# EasyEDA Pro project DPOV1.epro, schematic 474开发板

## Sheets
1 P1_CORE: Board Name: G474CORE; Create Date: 2025-02-21; Page Name: P1_CORE; Project Name: 大创; Schematic Name: 474开发板; Update Date: 2025-03-01; Company: 嘉立创EDA
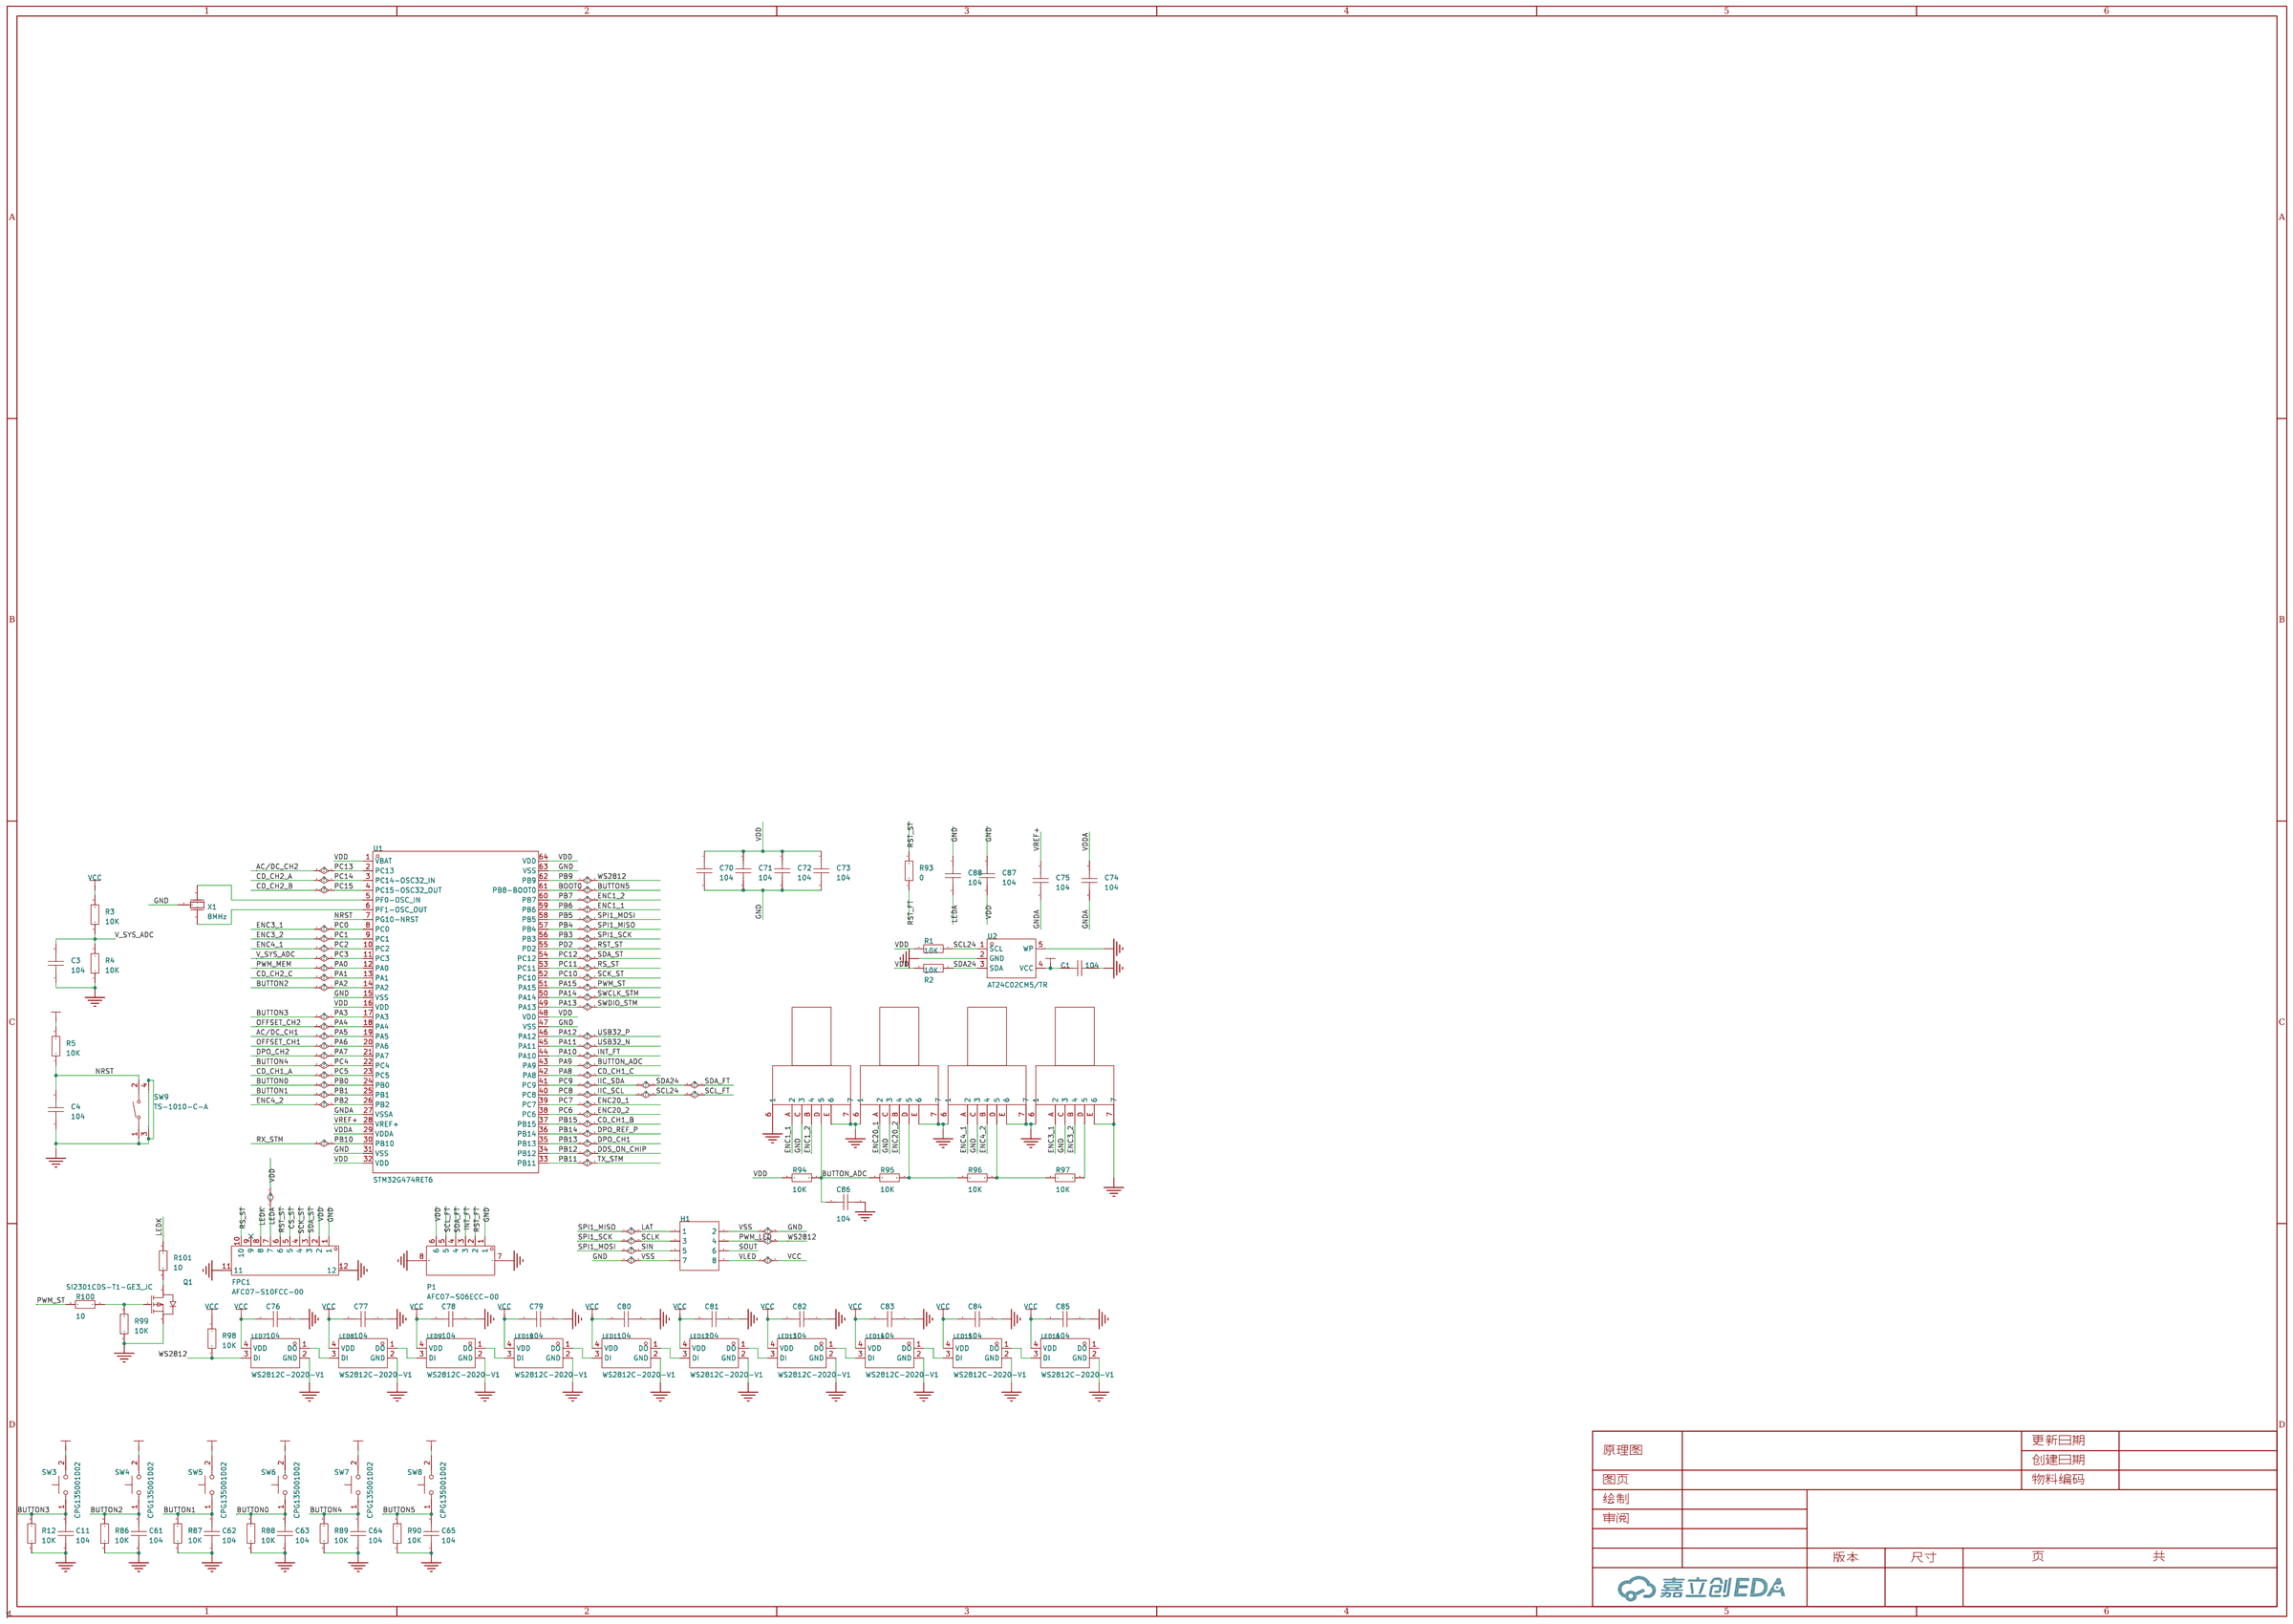
[diagram p0: P1_CORE]
2 P2_POWER: Create Date: 2025-02-23; Page Name: P2_POWER; Update Date: 2025-02-27
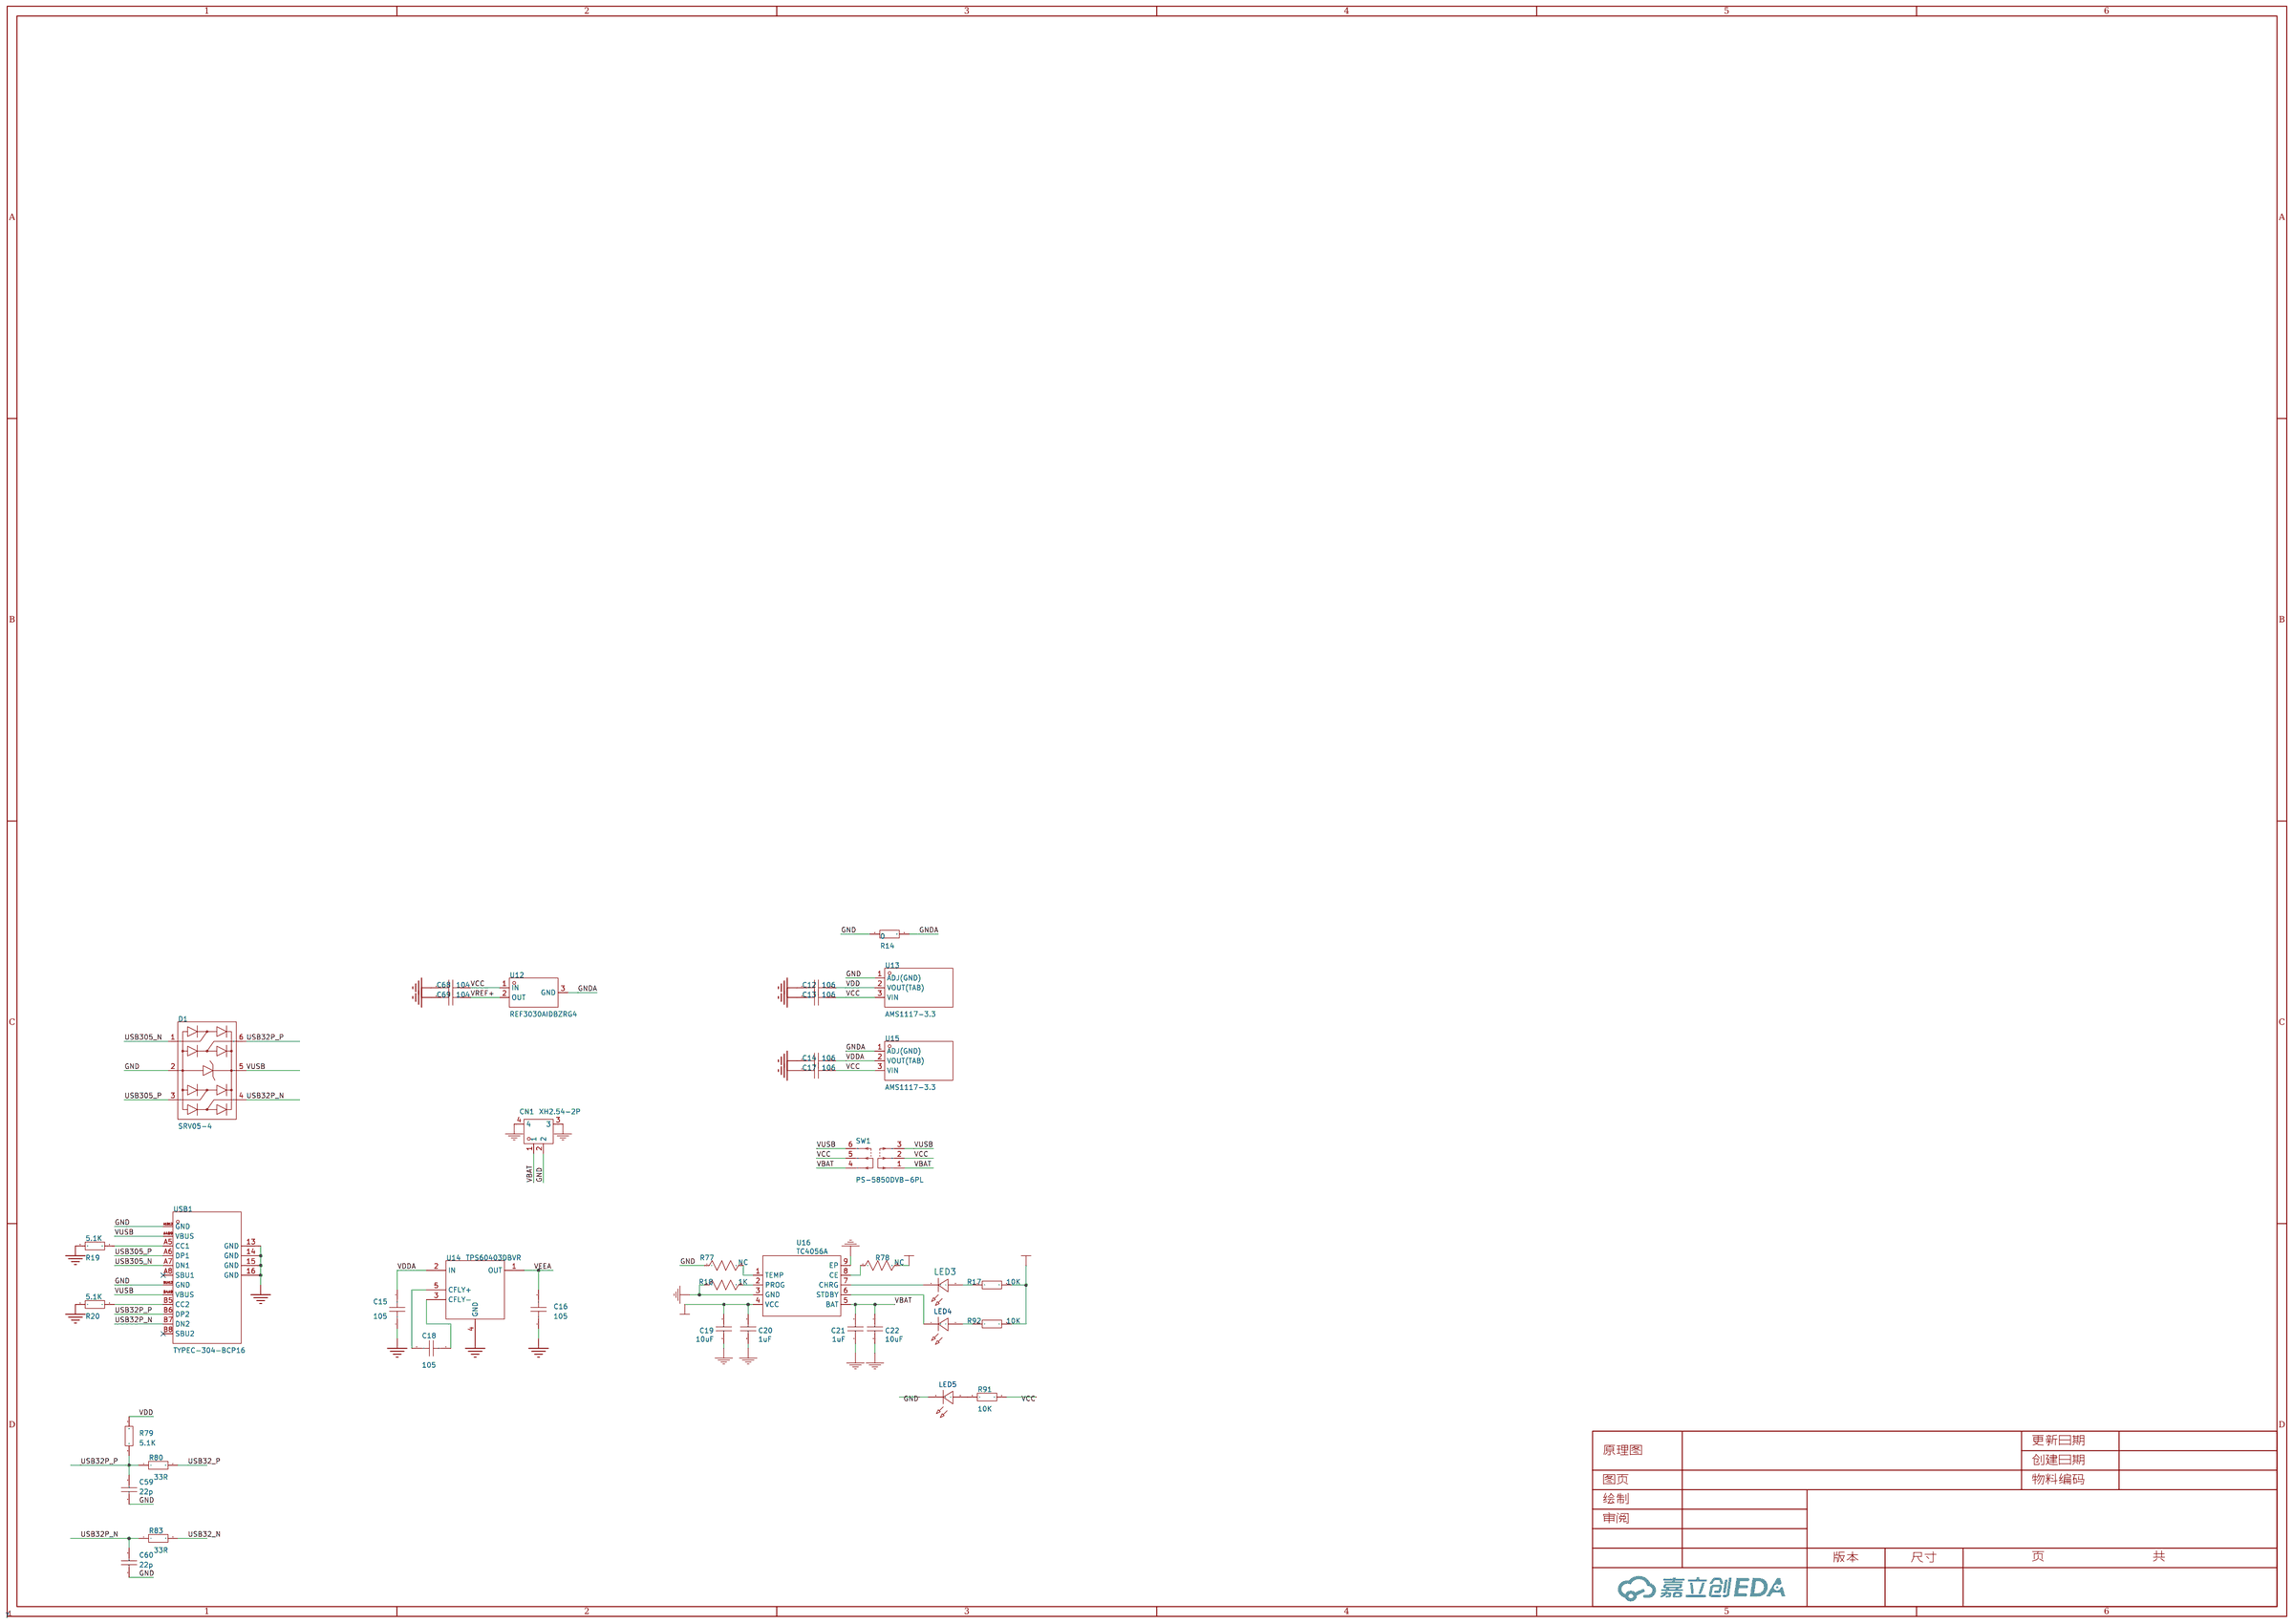
[diagram p1: P2_POWER]
3 P3_ANALOG: Create Date: 2025-02-23; Page Name: P3_ANALOG; Update Date: 2025-03-04
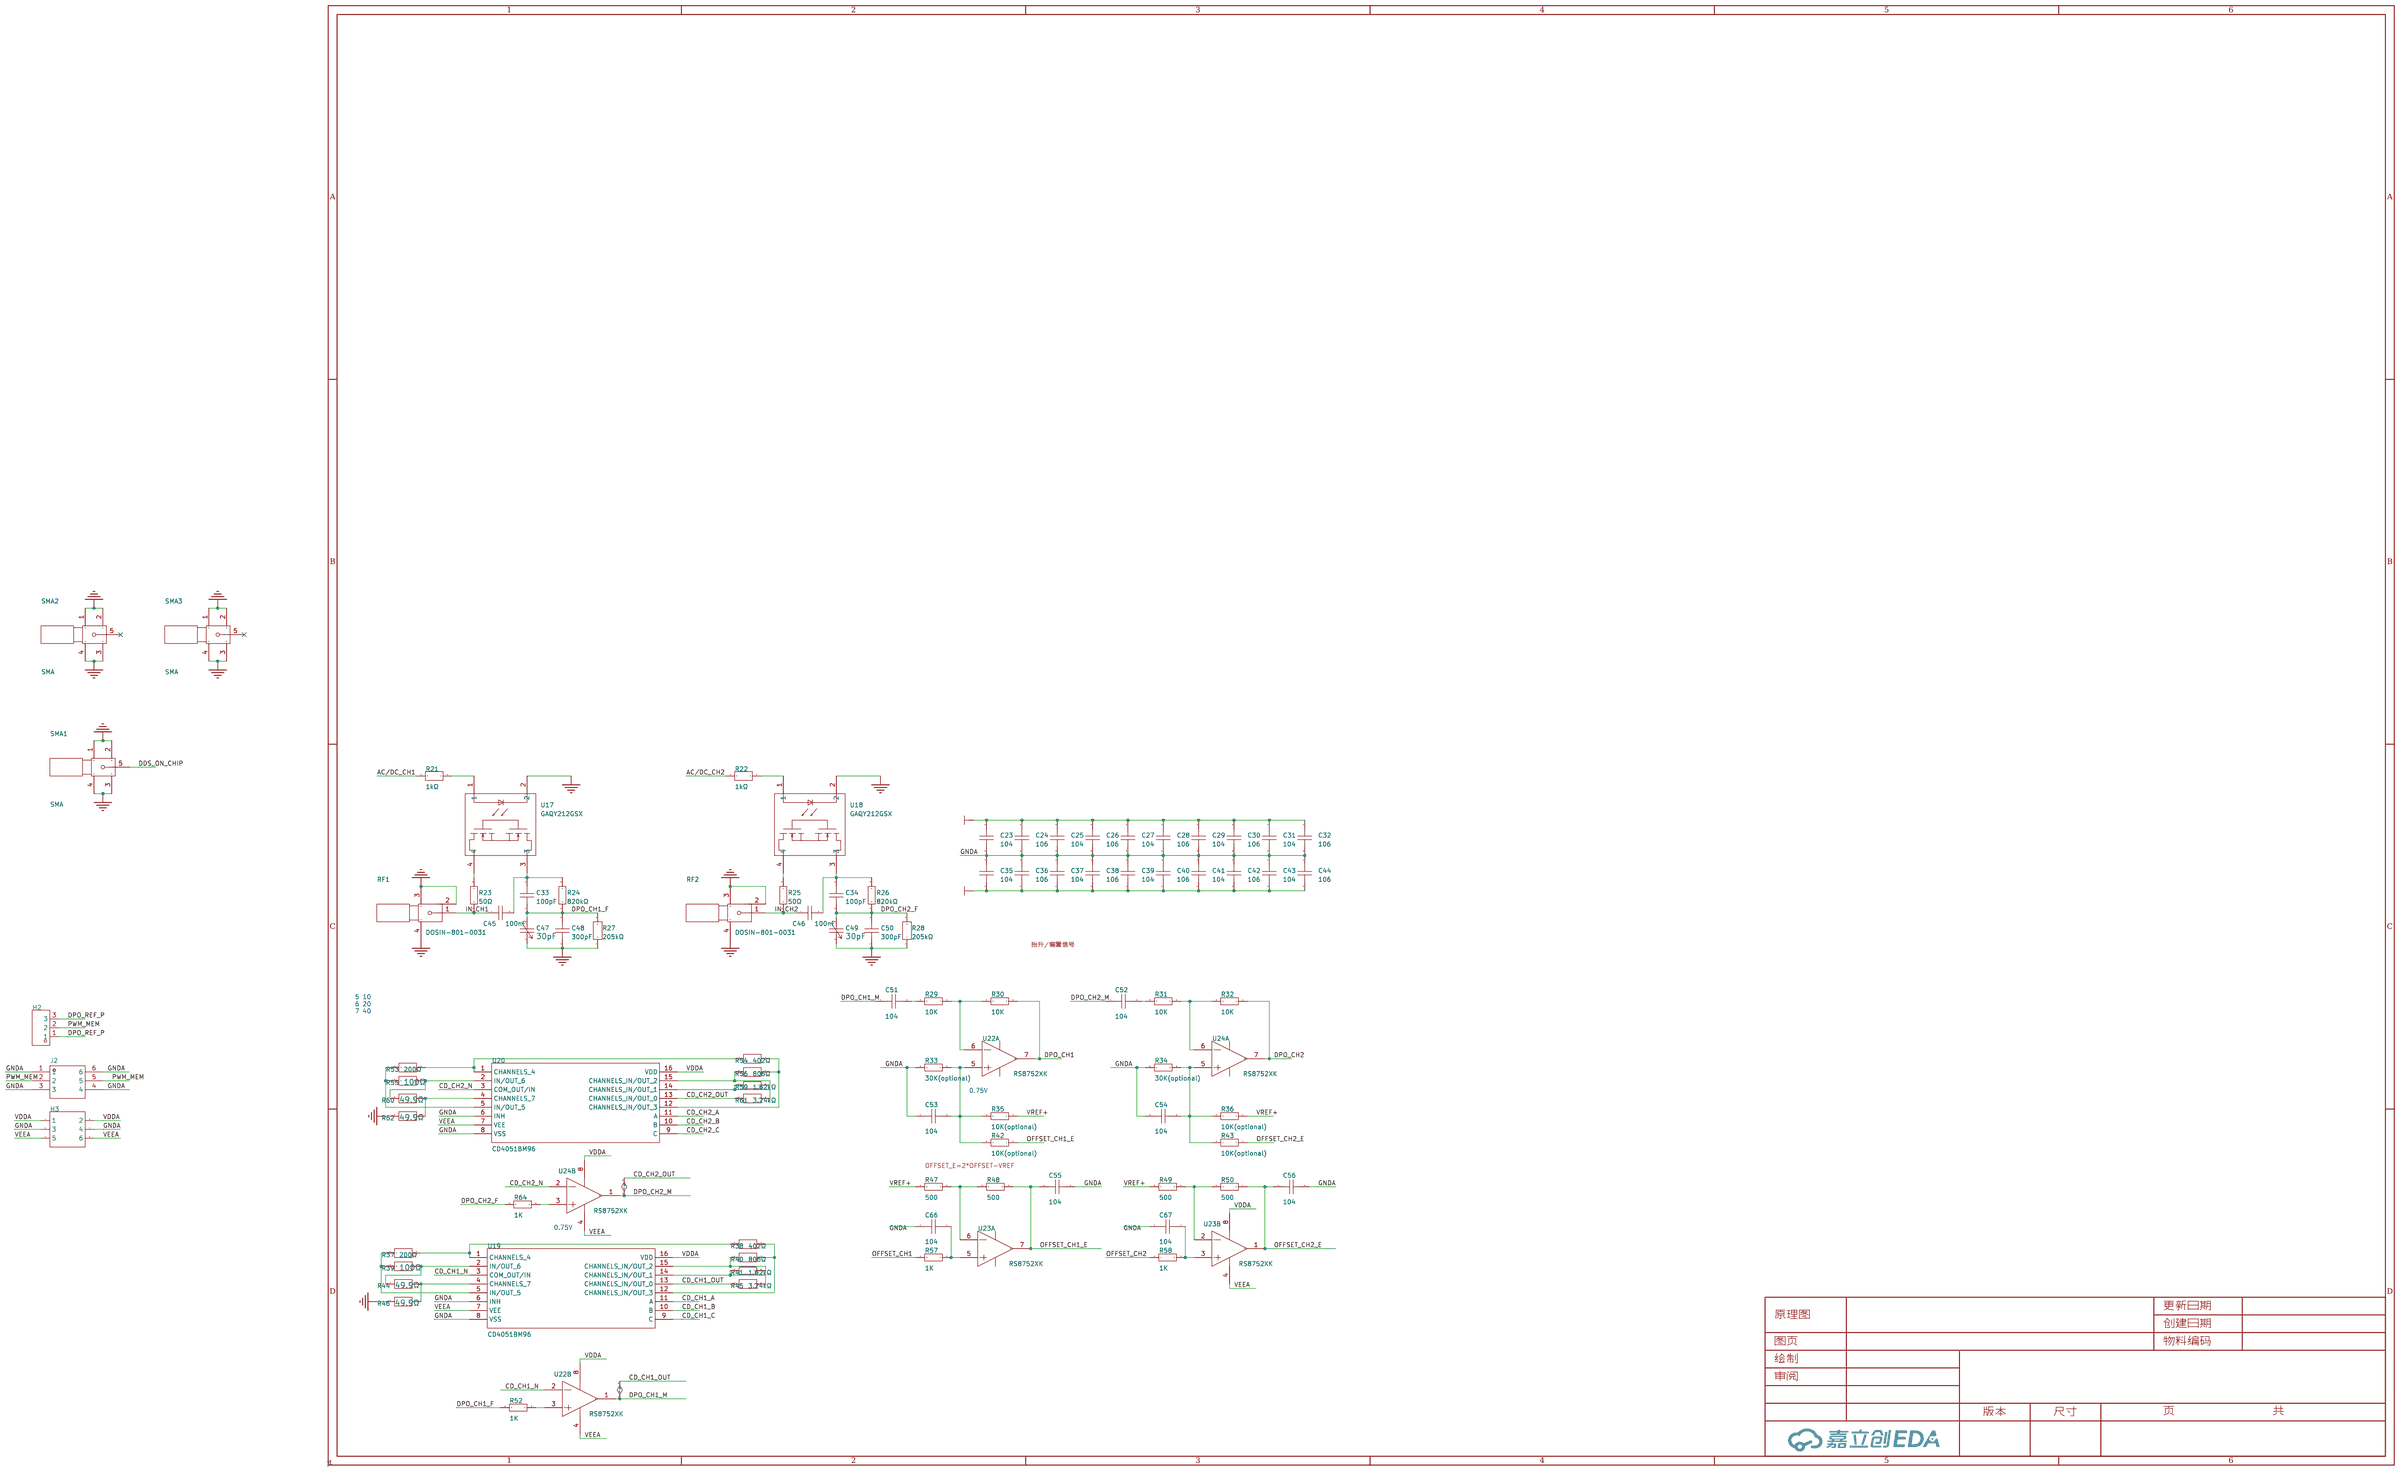
[diagram p2: P3_ANALOG]
4 P4_DAP: Create Date: 2025-02-24; Page Name: P4_DAP; Update Date: 2025-02-27; Page Size: A3; Version: V1.0
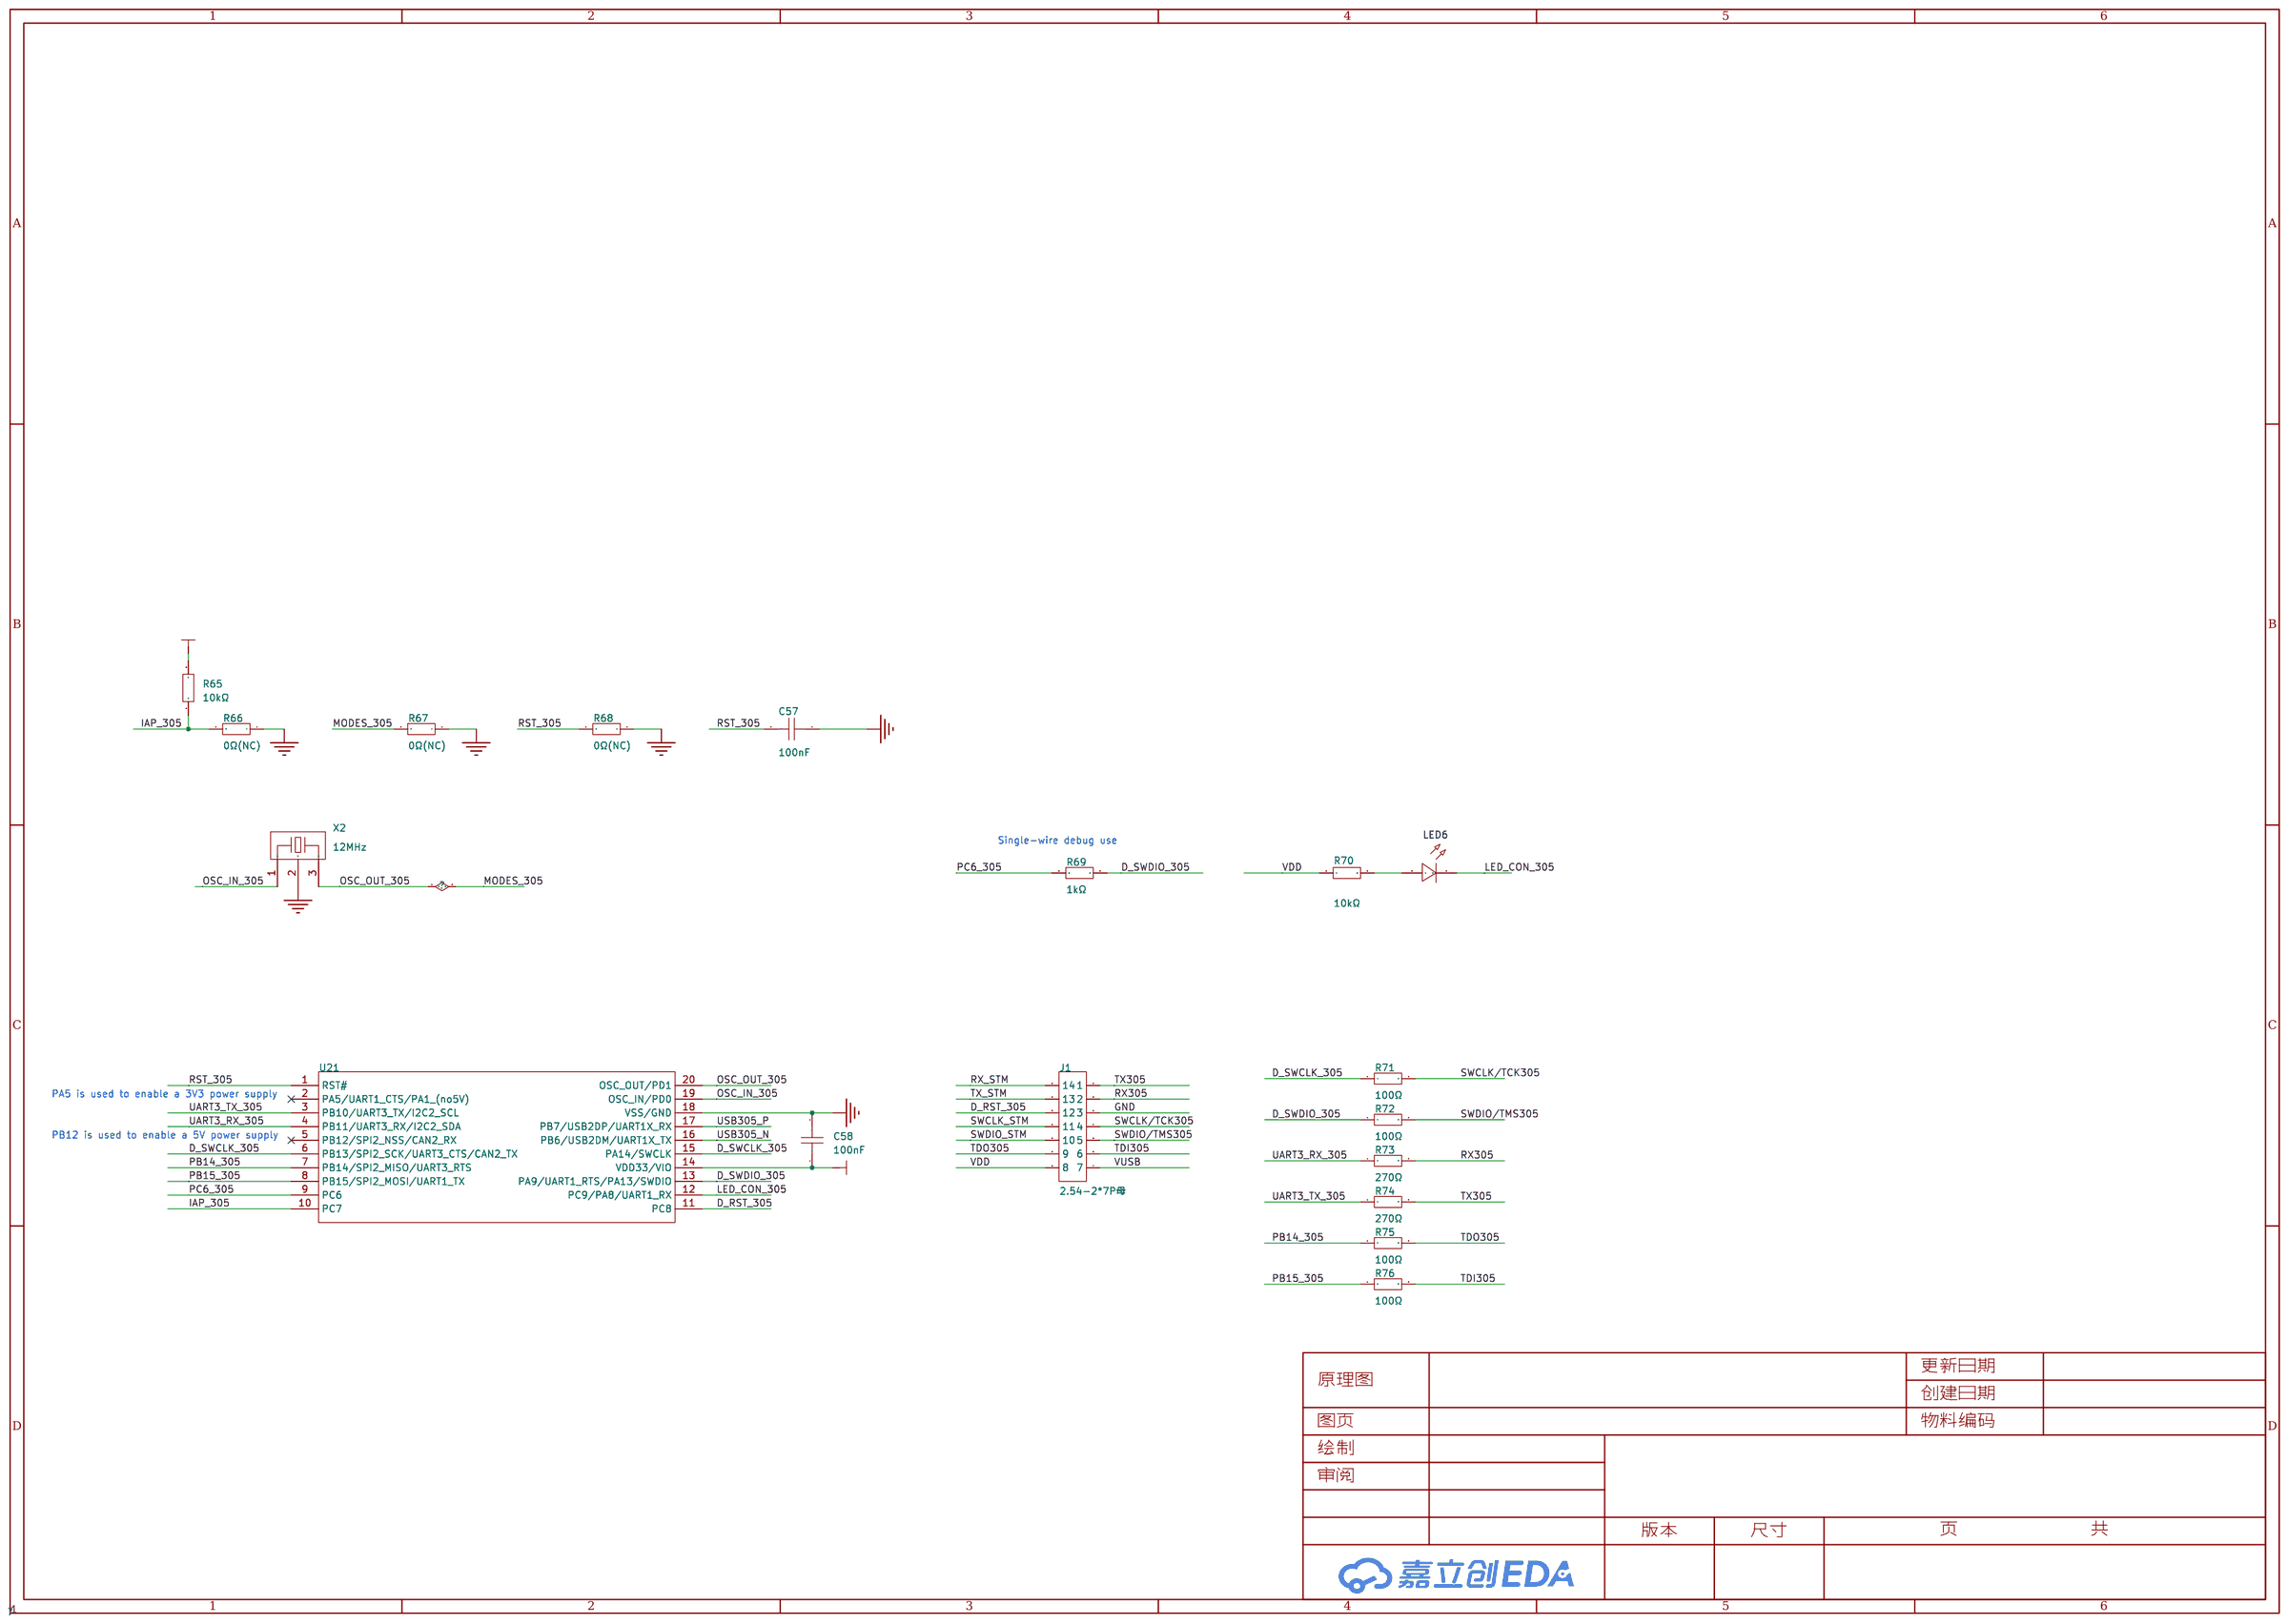
[diagram p3: P4_DAP]

## Parts
sheet P1_CORE
C1  104  [C0603]
C3  104  [C0603]
C4  104  [C0603]
C11  104  [C0603]
C61  104  [C0603]
C62  104  [C0603]
C63  104  [C0603]
C64  104  [C0603]
C65  104  [C0603]
C70  104  [C0603]
C71  104  [C0603]
C72  104  [C0603]
C73  104  [C0603]
C74  104  [C0603]
C75  104  [C0603]
C76  104  [C0603]
C77  104  [C0603]
C78  104  [C0603]
C79  104  [C0603]
C80  104  [C0603]
C81  104  [C0603]
C82  104  [C0603]
C83  104  [C0603]
C84  104  [C0603]
C85  104  [C0603]
C86  104  [C0603]
C87  104  [C0603]
C88  104  [C0603]
EC1  -  [ec11卧式立式编码器]
EC2  -  [ec11卧式立式编码器]
EC3  -  [ec11卧式立式编码器]
EC4  -  [ec11卧式立式编码器]
FPC1  AFC07-S10FCC-00  [FPC-SMD_P0.5-10P_LSXJ-H2.0-10P]
H1  -  [HDR-TH_8P-P2.54-V-F-R2-C4-S2.54-1]
LED7  WS2812C-2020-V1  [LED-SMD_4P-L2.0-W2.0-TL_WS2812B-2020]
LED8  WS2812C-2020-V1  [LED-SMD_4P-L2.0-W2.0-TL_WS2812B-2020]
LED9  WS2812C-2020-V1  [LED-SMD_4P-L2.0-W2.0-TL_WS2812B-2020]
LED10  WS2812C-2020-V1  [LED-SMD_4P-L2.0-W2.0-TL_WS2812B-2020]
LED11  WS2812C-2020-V1  [LED-SMD_4P-L2.0-W2.0-TL_WS2812B-2020]
LED12  WS2812C-2020-V1  [LED-SMD_4P-L2.0-W2.0-TL_WS2812B-2020]
LED13  WS2812C-2020-V1  [LED-SMD_4P-L2.0-W2.0-TL_WS2812B-2020]
LED14  WS2812C-2020-V1  [LED-SMD_4P-L2.0-W2.0-TL_WS2812B-2020]
LED15  WS2812C-2020-V1  [LED-SMD_4P-L2.0-W2.0-TL_WS2812B-2020]
LED16  WS2812C-2020-V1  [LED-SMD_4P-L2.0-W2.0-TL_WS2812B-2020]
P1  AFC07-S06ECC-00  [FPC-SMD_AFC07-S06ECC-00]
Q1  SI2301CDS-T1-GE3_JC  [SOT-23-3_L3.0-W1.7-P0.95-LS2.9-BR]
R1  10K  [R0603]
R2  10K  [R0603]
R3  10K  [R0603]
R4  10K  [R0603]
R5  10K  [R0603]
R12  10K  [R0603]
R86  10K  [R0603]
R87  10K  [R0603]
R88  10K  [R0603]
R89  10K  [R0603]
R90  10K  [R0603]
R93  0  [R0603]
R94  10K  [R0603]
R95  10K  [R0603]
R96  10K  [R0603]
R97  10K  [R0603]
R98  10K  [R0603]
R99  10K  [R0603]
R100  10  [R0603]
R101  10  [R0603]
SW3  CPG135001D02  [KEY-TH_CPG135001D0X]
SW4  CPG135001D02  [KEY-TH_CPG135001D0X]
SW5  CPG135001D02  [KEY-TH_CPG135001D0X]
SW6  CPG135001D02  [KEY-TH_CPG135001D0X]
SW7  CPG135001D02  [KEY-TH_CPG135001D0X]
SW8  CPG135001D02  [KEY-TH_CPG135001D0X]
SW9  TS-1010-C-A  [KEY-SMD_TX-1010-X-X]
U1  STM32G474RET6  [LQFP-64_L10.0-W10.0-P0.50-LS12.0-BL]
U2  AT24C02CM5/TR  [SOT-23-5_L2.9-W1.6-P0.95-LS2.8-BR]
X1  8MHz  [OSC-SMD_3P-L3.2-W1.3-P1.20-L]
sheet P2_POWER
C12  106  [C0805]
C13  106  [C0805]
C14  106  [C0805]
C15  105  [C0603]
C16  105  [C0603]
C17  106  [C0805]
C18  105  [C0603]
C19  10uF  [C0805]
C20  1uF  [C0603]
C21  1uF  [C0603]
C22  10uF  [C0805]
C59  22p  [C0603]
C60  22p  [C0603]
C68  104  [C0603]
C69  104  [C0603]
CN1  XH2.54-2P  [CONN-SMD_2P-P2.50-WT]
D1  SRV05-4  [SOT-23-6_L2.9-W1.6-P0.95-LS2.8-BL]
LED3  -  [LED_0603]
LED4  -  [LED_0603]
LED5  -  [LED_0603]
R14  0  [R0603]
R17  10K  [R0603]
R18  1K  [R0603]
R19  5.1K  [R0603]
R20  5.1K  [R0603]
R77  NC  [R0603]
R78  NC  [R0603]
R79  5.1K  [R0603]
R80  33R  [R0603]
R83  33R  [R0603]
R91  10K  [R0603]
R92  10K  [R0603]
SW1  PS-5850DVB-6PL  [SW-TH_6P-L5.8-W5.8-P2.00-LS4.5-BL_1]
U12  REF3030AIDBZRG4  [SOT-23-3_L2.9-W1.3-P1.90-LS2.4-BR]
U13  AMS1117-3.3  [SOT-89_L4.5-W2.5-P1.50-LS4.2-BR]
U14  TPS60403DBVR  [SOT-23-5_L3.0-W1.7-P0.95-LS2.8-BR]
U15  AMS1117-3.3  [SOT-89_L4.5-W2.5-P1.50-LS4.2-BR]
U16  TC4056A  [SOP-8_L4.9-W3.9-P1.27-LS6.0-BL-EP]
USB1  TYPEC-304-BCP16  [USB-C-SMD_TYPEC-304-BCP16]
sheet P3_ANALOG
C23  104  [C0603]
C24  106  [C0603]
C25  104  [C0603]
C26  106  [C0603]
C27  104  [C0603]
C28  106  [C0603]
C29  104  [C0603]
C30  106  [C0603]
C31  104  [C0603]
C32  106  [C0603]
C33  100pF  [C0603]
C34  100pF  [C0603]
C35  104  [C0603]
C36  106  [C0603]
C37  104  [C0603]
C38  106  [C0603]
C39  104  [C0603]
C40  106  [C0603]
C41  104  [C0603]
C42  106  [C0603]
C43  104  [C0603]
C44  106  [C0603]
C45  100nF  [C1206]
C46  100nF  [C1206]
C47  30pF  [CAP-ADJ-SMD_L4.5-W3.2-L]
C48  300pF  [C0603]
C49  30pF  [CAP-ADJ-SMD_L4.5-W3.2-L]
C50  300pF  [C0603]
C51  104  [C0603]
C52  104  [C0603]
C53  104  [C0603]
C54  104  [C0603]
C55  104  [C0603]
C56  104  [C0603]
C66  104  [C0603]
C67  104  [C0603]
H2  -  [HDR-TH_3P-P2.54-V-F]
H3  -  [HDR-TH_6P-P2.54-V-F-R2-C3-S2.54]
J2  -  [侧插排针_3Px2_2.54]
R21  1kΩ  [R0603]
R22  1kΩ  [R0603]
R23  50Ω  [R0603]
R24  820kΩ  [R0603]
R25  50Ω  [R0603]
R26  820kΩ  [R0603]
R27  205kΩ  [R0603]
R28  205kΩ  [R0603]
R29  10K  [R0603]
R30  10K  [R0603]
R31  10K  [R0603]
R32  10K  [R0603]
R33  30K(optional)  [R0603]
R34  30K(optional)  [R0603]
R35  10K(optional)  [R0603]
R36  10K(optional)  [R0603]
R37  200Ω  [R0603]
R38  402Ω  [R0603]
R39  100Ω  [R0603]
R40  806Ω  [R0603]
R41  1.62kΩ  [R0603]
R42  10K(optional)  [R0603]
R43  10K(optional)  [R0603]
R44  49.9Ω  [R0603]
R45  3.24kΩ  [R0603]
R46  49.9Ω  [R0603]
R47  500  [R0603]
R48  500  [R0603]
R49  500  [R0603]
R50  500  [R0603]
R52  1K  [R0603]
R53  200Ω  [R0603]
R54  402Ω  [R0603]
R55  100Ω  [R0603]
R56  806Ω  [R0603]
R57  1K  [R0603]
R58  1K  [R0603]
R59  1.62kΩ  [R0603]
R60  49.9Ω  [R0603]
R61  3.24kΩ  [R0603]
R62  49.9Ω  [R0603]
R64  1K  [R0603]
RF1  DOSIN-801-0031  [BNC-TH_DOSIN-801-0030]
RF2  DOSIN-801-0031  [BNC-TH_DOSIN-801-0030]
SMA1  SMA  [SMA-SMD_BWSMA-KE-P001]
SMA2  SMA  [SMA-SMD_BWSMA-KE-P001]
SMA3  SMA  [SMA-SMD_BWSMA-KE-P001]
U17  GAQY212GSX  [SOP-4_L4.3-W4.4-P2.54-LS6.8-TR]
U18  GAQY212GSX  [SOP-4_L4.3-W4.4-P2.54-LS6.8-TR]
U19  CD4051BM96  [SOIC-16_L9.9-W3.9-P1.27-LS6.0-BL]
U20  CD4051BM96  [SOIC-16_L9.9-W3.9-P1.27-LS6.0-BL]
U22  RS8752XK  [SOIC-8_L4.9-W3.9-P1.27-LS6.0-BL]  (sections 1,2)
U23  RS8752XK  [SOIC-8_L4.9-W3.9-P1.27-LS6.0-BL]  (sections 1,2)
U24  RS8752XK  [SOIC-8_L4.9-W3.9-P1.27-LS6.0-BL]  (sections 1,2)
sheet P4_DAP
C57  100nF  [C0603]
C58  100nF  [C0603]
J1  2.54-2*7P母  [排母_2X7P_2.54_双层]
LED6  -  [LED_0603]
R65  10kΩ  [R0603]
R66  0Ω(NC)  [R0603]
R67  0Ω(NC)  [R0603]
R68  0Ω(NC)  [R0603]
R69  1kΩ  [R0603]
R70  10kΩ  [R0603]
R71  100Ω  [R0603]
R72  100Ω  [R0603]
R73  270Ω  [R0603]
R74  270Ω  [R0603]
R75  100Ω  [R0603]
R76  100Ω  [R0603]
U21  -  [TSSOP-20_L6.5-W4.4-P0.65-LS6.4-BL]
X2  12MHz  [OSC-SMD_3P-L3.2-W1.3-P1.2-L]

## Library data of the parts
C1 C3 C4 C11 C23-C32 C35-C44 C51-C56 C61-C67 C70-C88 = CAP_0603: Supplier Footprint: 0603
EC1-EC4 = ec11卧式: ec11卧式 厚底 带开关 15MM
FPC1 = AFC07-S10FCC-00: 锁定特性:抽屉式;触点类型:下接;触点数量:10P;间距:0.5mm;安装类型:卧贴;; LCSC Part Name: 间距:0.5mm P数:10P 抽屉式 下接; Supplier Part: C11050; Manufacturer: JS(钜硕电子); Supplier Footprint: SMD,P=0.5mm,卧贴; JLCPCB Part Class: 扩展库; Datasheet: https://atta.szlcsc.com/upload/public/pdf/source/20190717/C405328_807FA67B3F1B55207D2BA590F8028B61.pdf; Supplier: LCSC; Locking Feature: 抽屉式; Contact Type: 下接; Number of Contacts: 10P; Pitch: 0.5mm; Mounting Type: 卧贴; FFC, FCB Thickness: 0.3mm; Height Above Board: 2mm
H1 = HDR-F_2.54_2x4: Supplier Part: C92271; Supplier Footprint: 插件
LED7-LED16 = WS2812C-2020-V1: 发光颜色:RGB三色;二极管配置:-;透镜颜色:-;主波长:624nm；520nm；467nm;色温:-;功率:-;发光角度:-;安装方式:-;工作温度:-;; LCSC Part Name: RGB三色 （注意防潮，请查阅规格书中对应具体内容）; Supplier Part: C2976072; Manufacturer: worldsemi; Supplier Footprint: SMD,2x2mm; JLCPCB Part Class: 扩展库; Datasheet: https://atta.szlcsc.com/upload/public/pdf/source/20220222/52A01000447F5320C9A8C3F34CEFDB81.pdf; Supplier: LCSC; Emitted Color: RGB三色; Dominant Wavelength: 624nm；520nm；467nm
P1 = AFC07-S06ECC-00: 锁定特性:抽屉式;触点类型:上接;触点数量:6P;间距:0.5mm;安装类型:卧贴;; LCSC Part Name: 间距:0.5mm P数:6P 抽屉式 上接; Supplier Part: C11083; Manufacturer: JS(钜硕电子); Supplier Footprint: SMD,P=0.5mm,卧贴; JLCPCB Part Class: 扩展库; Datasheet: https://atta.szlcsc.com/upload/public/pdf/source/20190816/C413943_B2A877D529C9540F79BD785FB8B72D0A.pdf; Supplier: LCSC; Locking Feature: 抽屉式; Contact Type: 上接; Number of Contacts: 6P; Pitch: 0.5mm; Mounting Type: 卧贴; FFC, FCB Thickness: 0.3mm; Height Above Board: 2mm
Q1 = SI2301CDS-T1-GE3_JC: link: https://item.szlcsc.com/139341.html; 3DModel: SOT-23-3L_L2.9-W1.6-H1.1-LS2.8-P0.95; Supplier: LCSC; Manufacturer: VISHAY; Manufacturer Part: SI2301CDS-T1-GE3; Supplier Part: C10487; JLCPCB Part Class: Basic Part
R1 R2 R14 R19 R20 R79 R80 R83 R98 = Res_0603: Supplier Footprint: 0603
R3-R5 R12 R17 R29-R36 R42 R43 R47-R50 R52 R57 R58 R64 R86-R97 R99-R101 = 1K: Supplier: LCSC; Manufacturer: UniOhm; Manufacturer Part: 0603WAJ0102T5E; Supplier Part: C25585
SW3-SW8 = CPG135001D02: 轴类型:茶轴;工作电压:12V;针脚数:2;操作力:50gf@±10gf;; LCSC Part Name: CHOC 茶轴; Supplier Part: C400230; Manufacturer: Kailh(凯华); Supplier Footprint: 插件; JLCPCB Part Class: 扩展库; Datasheet: https://atta.szlcsc.com/upload/public/pdf/source/20190626/C400230_CD79EE7C25BDE8A0B9D940627C7F841C.pdf; Supplier: LCSC; Axis Type: 茶轴; Operating Voltage: 12V; Pin: 2; Mechanical Life: 7000万次; Operation Force: 50gf@±10gf; Conduction Travel: 1.5mm; Total Travel: 3mm; Operating Temperature: -20℃~+80℃
SW9 = TS-1010-C-A: 电路结构:单刀单掷;按钮形状:矩形按钮;作用力:260gf;安装方式:卧贴;开关长度:2.3mm;开关宽度:4.7mm;开关高度:3.5mm;带支架:不带;触点电流:50mA;额定电压(AC):-;额定电压(DC):12V;额定功率:-;绝缘电阻:-;带灯:无;机械寿命:10万次;; LCSC Part Name: 2.3*4.7*3.5mm 卧贴 轻触开关; Supplier Part: C692458; Manufacturer: XKB Connectivity(中国星坤); Supplier Footprint: SMD; JLCPCB Part Class: 扩展库; Datasheet: https://atta.szlcsc.com/upload/public/pdf/source/20211011/09621D275CE0F472C941775DFBBCCC96.pdf; Supplier: LCSC; Circuit: 单刀单掷; Actuator Style: 矩形按钮; Operating Force: 260gf; Mounting Style: 卧贴; Switch Length: 2.3mm; Switch Width: 4.7mm; Switch Height: 3.5mm; Strike Gundam: 不带; Contact Current: 50mA; Voltage Rating (DC): 12V; Actuator/Cap Color: 黑色; With Lamp: 无; Mechanical Life: 10万次; Operating Temperature: -30℃~+85℃
U1 = STM32G474RET6: CPU内核:ARM-M4;CPU最大主频:170MHz;应用领域:-;; LCSC Part Name: 带DSP和FPU的170MHz主流ARM Cortex-M4 MCU，具有512 KB Flash存储器、数学加速器、高分辨率定时器和高模拟电平集成; Supplier Part: C521608; Manufacturer: ST(意法半导体); Supplier Footprint: LQFP-64(10x10); JLCPCB Part Class: 扩展库; Datasheet: https://atta.szlcsc.com/upload/public/pdf/source/20200902/C431632_38212262685EE30B1989689374F08940.pdf; Supplier: LCSC; CPU Core: ARM-M4; CPU Maximum Speed: 170MHz; Program Storage Size: 512KB; Program Memory Type: FLASH; Number of I/O: 52; ADC (Bit): 12bit; DAC (Bit): 12bit; Low Voltage Detection Threshold: 1.71V~3.6V
U2 = AT24C02CM5/TR: 存储容量:2Kbit;; Supplier Part: C7432363; Manufacturer: HGSEMI(华冠); Supplier Footprint: SOT23-5; Datasheet: https://atta.szlcsc.com/upload/public/pdf/source/20231225/2784EBC5D3B0DE823E6E0FE836346417.pdf; Supplier: LCSC; Memory Size: 2Kbit
X1 = CSTNE8M00G550000R0: 频率:8MHz;内置负载电容:33pF;谐振阻抗:40Ω;; LCSC Part Name: 8MHz ±0.5% 内置负载电容:33pF; Supplier Part: C341522; Manufacturer: muRata(村田); Supplier Footprint: SMD3213-3P; JLCPCB Part Class: 扩展库; Datasheet: https://atta.szlcsc.com/upload/public/pdf/source/20200921/C341522_F8E1D39D851DC808AB58F6F0A3A6E62B.pdf; Supplier: LCSC; Built-in Load Capacitance: 33pF; Resonant Impedance: 40Ω; Operating Temperature: -40℃~+85℃
C12-C14 C17 = CAP_0805: Supplier Footprint: 0805
C15 C16 C18 = CAP_0603: Supplier Footprint: 0805
C19 C22 = 10uF: Supplier: LCSC; Manufacturer Part: CL21A106KOQNNNE; Manufacturer: SAMSUNG; Supplier Part: C1713
C20 C21 C59 C60 = 1uF: Supplier: LCSC; Manufacturer Part: CL10A105KO8NNNC; Manufacturer: SAMSUNG; Supplier Part: C1592
C68 C69 = CAP_0805
CN1 = XH2.54-2P: Supplier Part: C9900004348; Supplier Footprint: XH2.54-2PSMD; JLCPCB Part Class: 扩展库; Supplier: LCSC
D1 = SRV05-4_C558418: 极性:单向;反向截止电压(Vrwm):5V;最大钳位电压:20V;峰值脉冲电流(Ipp):3A;峰值脉冲功率(Ppp):60W;击穿电压:6V;; LCSC Part Name: ESD，可防25kV静电; Supplier Part: C558418; Manufacturer: TECH PUBLIC(台舟); Supplier Footprint: SOT-23-6; JLCPCB Part Class: 扩展库; Datasheet: https://atta.szlcsc.com/upload/public/pdf/source/20230615/CFFDFFE99FDA0E92DF9600783B3A2A20.pdf; Supplier: LCSC; polarity: 单向; Reverse Stand-Off Voltage (Vrwm): 5V; Maximum Clamping Voltage: 20V; Peak Pulse Current (Ipp): 3A; Peak Pulse Power Dissipation (Ppp): 60W; Breakdown Voltage: 6V; Reverse Leakage Current (Ir): 500nA; Number of Lines: 四路; Operating Temperature: -55℃~+125℃; level of protection: IEC 61000-4-2; Type: ESD
LED3 = LED_0603-R: Supplier Footprint: 0603
LED4 LED6 = LED_0603-G: Supplier Footprint: 0603
LED5 = LED_0603-B: Supplier Footprint: 0603
R18 R77 R78 = 2K
SW1 = PS-5850DVB-6PL: 触点电流:500mA;额定电压 (DC):24V;; LCSC Part Name: 5.8×5.8六脚插板按键开关 自锁 250gf 3万寿命; Supplier Part: C5362624; Manufacturer: G-Switch(品赞); Supplier Footprint: 插件-6P,5.8x5.8mm; JLCPCB Part Class: 扩展库; Datasheet: https://atta.szlcsc.com/upload/public/pdf/source/20240529/335105E18CBD9563AE4F09DBBFA4E8D9.pdf; Supplier: LCSC; Contact Current: 500mA; Voltage Rating (DC): 24V; Insulation Resistance: 100MΩ; Actuator/Cap Color: 白色; Operating Temperature: -40℃~+85℃
U12 = REF3030AIDBZRG4: 输出类型:固定;输入电压:3.05V~5.5V;输出电压:3V;输出电流:25mA;精度:±0.2%;; Supplier Part: C2157098; Manufacturer: TI(德州仪器); Supplier Footprint: SOT-23-3; JLCPCB Part Class: 扩展库; Datasheet: https://www.ti.com/cn/lit/gpn/ref3012; Supplier: LCSC; Output Type: 固定; Input Voltage: 3.05V~5.5V; Output Voltage: 3V; Output Current: 25mA; Tolerance: ±0.2%; Temperature Coefficient: 75ppm/℃; Reference Type: 串联; Supply Current: 50uA; Noise - 1/10Hz to 10Hz: 33uVp-p; Noise - 10Hz to 10kHz: 94uVrms; Operating Temperature: -40℃~+125℃@(Ta)
U13 U15 = AMS1117-3.3_C347256: 输出类型:固定;最大输入电压:12V;输出电压:3.3V;最大输出电流:1A;电源纹波抑制比(PSRR):60dB@(120Hz);输出极性:正极;; LCSC Part Name: 输出:3.3V 电流:1A 耐压:12V; Supplier Part: C347256; Manufacturer: UMW(友台半导体); Supplier Footprint: SOT-89; JLCPCB Part Class: 扩展库; Datasheet: https://atta.szlcsc.com/upload/public/pdf/source/20231109/155D79A26D9DB04352555A58D5969DC8.pdf; Supplier: LCSC; Output Type: 固定; Maximum Input Voltage: 12V; Output Voltage: 3.3V; MAX Output Current: 1A; Power Supply Rejection Ratio (PSRR): 60dB@(120Hz); Dropout Voltage: 1.3V@(1A); Output Polarity: 正极; Number of Outputs: 1
U14 = TPS60403DBVR: TPS60403 具有固定 250kHz 操作的 60mA 充电泵电压反向器; Supplier Part: C11338; Manufacturer: TI(德州仪器); Supplier Footprint: SOT-23-5; Datasheet: https://www.ti.com/cn/lit/gpn/tps60403; Supplier: LCSC
U16 = TC4056A: Supplier: LCSC; Manufacturer: FM; Supplier Part: C84051; JLCPCB Part Class: Extend
USB1 = TYPEC-304-BCP16_C720629: 连接器类型:Type-C;标准:USB 3.1;公母:母;端口数量:1;触点数量:16P;安装方式:卧贴;额定电流 - 电源:3A;工作温度范围:-25℃~+85℃;焊接温度(最大值):260℃;; LCSC Part Name: Type-C 母 卧贴 停产; Supplier Part: C720629; Manufacturer: XUNPU(讯普); Supplier Footprint: SMD; JLCPCB Part Class: 扩展库; Datasheet: https://atta.szlcsc.com/upload/public/pdf/source/20220210/1FE0FEFF7D6A20C111212527D3DED014.pdf; Supplier: LCSC; Connector Type: Type-C; Standard: USB 3.1; Gender: 母; Number of Ports: 1; Number of Contacts: 16P; Mounting Style: 卧贴; Current Rating - Power (Max): 3A; Operating Temperature Range: -25℃~+85℃; Soldering Temperature(Max): 260℃
C33 C34 = CC0603KRX7R9BB101: 容值:100pF;精度:±10%;额定电压:50V;材质(温度系数):X7R;; LCSC Part Name: 100pF±10%50V; Supplier Part: C160903; Manufacturer: YAGEO(国巨); Supplier Footprint: 0603; JLCPCB Part Class: ExtendedPart; Datasheet: https://atta.szlcsc.com/upload/public/pdf/source/20171221/C160903_15138401031061196218.pdf; Supplier: LCSC; Tolerance: ±10%; Voltage Rated: 50V; Temperature Coefficient: X7R
C45 C46 = GRM31C5C1H104JA01L: 容值:100nF;精度:±5%;额定电压:50V;材质(温度系数):C0G;; LCSC Part Name: 100nF±5%50V; Supplier Part: C97946; Manufacturer: muRata(村田); Supplier Footprint: 1206; JLCPCB Part Class: 扩展库; Datasheet: https://atta.szlcsc.com/upload/public/pdf/source/20180228/C97946_15198056954501377706.pdf; Supplier: LCSC; Tolerance: ±5%; Voltage Rated: 50V; Temperature Coefficient: C0G
C47 C49 = TZC3P300A110R00: 静电容量:6.5pF~30pF;静电容量公差:0%~+50%;额定电压(Vdc):100V;Q值:300@1MHz;工作温度:-25~+85;电容体长:-;电容体宽:-;电容体高:-;; LCSC Part Name: 6.5pF~30pF0%~+50%; Supplier Part: C107707; Manufacturer: muRata(村田); Supplier Footprint: SMD,4.5x3.2x1.6mm; JLCPCB Part Class: 扩展库; Datasheet: https://atta.szlcsc.com/upload/public/pdf/source/20190308/C107707_FDFA4272F903C73E80F4FCF3941301D8.pdf; Supplier: LCSC; electrostatic capacity: 6.5pF~30pF; Tolerance: 0%~+50%; Rated Voltage: 100V; Q @ Freq: 300@1MHz; Operating Temperature: -25~+85
C48 C50 = 0603B301K500NT: 容值:300pF;精度:±10%;额定电压:50V;温度系数:X7R;; LCSC Part Name: 300pF±10%50V; Supplier Part: C1610; Manufacturer: FH(风华); Supplier Footprint: 0603; JLCPCB Part Class: ExtendedPart; Datasheet: https://atta.szlcsc.com/upload/public/pdf/source/20170923/C1610_1506149291282988409.pdf; Supplier: LCSC; Tolerance: ±10%; Voltage Rated: 50V; Temperature Coefficient: X7R
H2 = HDR-F_2.54_1x3P: Supplier Part: C541850; Supplier Footprint: 插件
H3 = HDR-F_2.54_2x3: Supplier Part: C92272; Supplier Footprint: 插件
J2 = 侧插排针_3Px2_2.54
R21 R22 = ERJ3EKF1743V: 阻值:174kΩ;精度:±1%;功率:100mW;温度系数:±100ppm/;最大工作电压:150V;工作温度范围:-55~+155;; LCSC Part Name: 174kΩ±1%100mW; Supplier Part: C400654; Manufacturer: PANASONIC(松下); Supplier Footprint: 0603; JLCPCB Part Class: 扩展库; Datasheet: https://atta.szlcsc.com/upload/public/pdf/source/20190625/C400654_D28930F178E2CC63F2998BCEC6060233.pdf; Supplier: LCSC; Tolerance: ±1%; Power(Watts): 100mW; Temperature Coefficient: ±100ppm/; Overload Voltage (Max): 150V; Operating Temperature Range: -55~+155
R23 R25 = RMS06FT8253: 精度:±1%;阻值:825kΩ;温度系数:±100ppm/;功率:1/10W;电阻类型:厚膜电阻;最大工作电压:50V;工作温度范围:-55~+155;; LCSC Part Name: 825kΩ±1%; Supplier Part: C209207; Manufacturer: 台湾大毅; Supplier Footprint: 0603; JLCPCB Part Class: 扩展库; Datasheet: https://atta.szlcsc.com/upload/public/pdf/source/20181220/C209207_DD44E2F6D51D02D6F55891039E79676D.pdf; Supplier: LCSC; Tolerance: ±1%; Temperature Coefficient: ±100ppm/; Power(Watts): 1/10W; Type: 厚膜电阻; Overload Voltage (Max): 50V; Operating Temperature Range: -55~+155
R24 R26 = RMS06FT8253: 精度:±1%;阻值:825kΩ;温度系数:±100ppm/;功率:1/10W;电阻类型:厚膜电阻;最大工作电压:50V;工作温度范围:-55~+155;; LCSC Part Name: 825kΩ±1%; Supplier Part: C322006; Manufacturer: 台湾大毅; Supplier Footprint: 0603; JLCPCB Part Class: 扩展库; Datasheet: https://atta.szlcsc.com/upload/public/pdf/source/20181220/C209207_DD44E2F6D51D02D6F55891039E79676D.pdf; Supplier: LCSC; Tolerance: ±1%; Temperature Coefficient: ±100ppm/; Power(Watts): 1/10W; Type: 厚膜电阻; Overload Voltage (Max): 50V; Operating Temperature Range: -55~+155
R27 R28 = ERJ3EKF1743V: 阻值:174kΩ;精度:±1%;功率:100mW;温度系数:±100ppm/;最大工作电压:150V;工作温度范围:-55~+155;; LCSC Part Name: 174kΩ±1%100mW; Supplier Part: C185351; Manufacturer: PANASONIC(松下); Supplier Footprint: 0603; JLCPCB Part Class: 扩展库; Datasheet: https://atta.szlcsc.com/upload/public/pdf/source/20190625/C400654_D28930F178E2CC63F2998BCEC6060233.pdf; Supplier: LCSC; Tolerance: ±1%; Power(Watts): 100mW; Temperature Coefficient: ±100ppm/; Overload Voltage (Max): 150V; Operating Temperature Range: -55~+155
R37 R53 = RC0603FR-07200RL: 阻值:200Ω;精度:±1%;功率:100mW;温度系数:±100ppm/℃;最大工作电压:75V;工作温度范围:-55℃~+155℃;; LCSC Part Name: 200Ω±1%100mW; Supplier Part: C114664; Manufacturer: YAGEO(国巨); Supplier Footprint: 0603; JLCPCB Part Class: ExtendedPart; Datasheet: https://atta.szlcsc.com/upload/public/pdf/source/20170912/C114664_1505207802969963457.pdf; Supplier: LCSC; Tolerance: ±1%; Power(Watts): 100mW; Temperature Coefficient: ±100ppm/℃; Overload Voltage (Max): 75V; Operating Temperature Range: -55℃~+155℃
R38 R54 = ERJ3EKF4020V: 阻值:402Ω;精度:±1%;功率:100mW;温度系数:±100ppm/;最大工作电压:-;工作温度范围:-55~+155;; LCSC Part Name: 402Ω±1%100mW; Supplier Part: C403205; Manufacturer: PANASONIC(松下); Supplier Footprint: 0603; JLCPCB Part Class: 扩展库; Datasheet: https://atta.szlcsc.com/upload/public/pdf/source/20190709/C403205_F6A86A0F3C62C4F5DB50373EB6C1874B.pdf; Supplier: LCSC; Tolerance: ±1%; Power(Watts): 100mW; Temperature Coefficient: ±100ppm/; Operating Temperature Range: -55~+155
R39 R55 = RC0603FR-07100RL: 电阻类型:厚膜电阻;阻值:100Ω;精度:±1%;功率:100mW;温度系数:±100ppm/℃;最大工作电压:75V;工作温度范围:-55℃~+155℃;; LCSC Part Name: 100Ω±1%; Supplier Part: C105588; Manufacturer: YAGEO(国巨); Supplier Footprint: 0603; JLCPCB Part Class: ExtendedPart; Datasheet: https://atta.szlcsc.com/upload/public/pdf/source/20170428/1493376742308.pdf; Supplier: LCSC; Type: 厚膜电阻; Tolerance: ±1%; Power(Watts): 100mW; Temperature Coefficient: ±100ppm/℃; Overload Voltage (Max): 75V; Operating Temperature Range: -55℃~+155℃
R40 R56 = ERJ3EKF8060V: 阻值:806Ω;精度:±1%;功率:100mW;温度系数:±100ppm/;最大工作电压:-;工作温度范围:-55~+155;; LCSC Part Name: 806Ω±1%100mW; Supplier Part: C403359; Manufacturer: PANASONIC(松下); Supplier Footprint: 0603; JLCPCB Part Class: 扩展库; Datasheet: https://atta.szlcsc.com/upload/public/pdf/source/20190709/C403359_871D5BE7DD5B880C89C75527D92BA999.pdf; Supplier: LCSC; Tolerance: ±1%; Power(Watts): 100mW; Temperature Coefficient: ±100ppm/; Operating Temperature Range: -55~+155
R41 R59 = WR06X1621FTL: 阻值:1.62kΩ;精度:±1%;功率:0.1W;温度系数:±100ppm/;; LCSC Part Name: 1.62kΩ±1%; Supplier Part: C170482; Manufacturer: 华新科(Walsin); Supplier Footprint: 0603; JLCPCB Part Class: 扩展库; Datasheet: https://atta.szlcsc.com/upload/public/pdf/source/20180228/C170482_15198082962341378514.pdf; Supplier: LCSC; Tolerance: ±1%; Power(Watts): 0.1W; Temperature Coefficient: ±100ppm/
R44 R46 R60 R62 = 0603WAF499JT5E: 精度:±1%;温度系数:±100ppm/℃;功率:1/10W;阻值:49.9Ω;最大工作电压:75V;工作温度范围:-55℃~+155℃;; LCSC Part Name: 49.9Ω±1%; Supplier Part: C23185; Manufacturer: UNI-ROYAL(厚声); Supplier Footprint: 0603; JLCPCB Part Class: BasicPart; Datasheet: https://atta.szlcsc.com/upload/public/pdf/source/20170920/C23185_1505901121294982568.pdf; Supplier: LCSC; Tolerance: ±1%; Temperature Coefficient: ±100ppm/℃; Power(Watts): 1/10W; Overload Voltage (Max): 75V; Operating Temperature Range: -55℃~+155℃
R45 R61 = CRCW06033K24FKEA: 工作温度范围:-55~+155;电阻长:-;精度:±1 %;电阻直径:-;最大工作电压:100V;电阻高:-;电阻宽:-;温度系数:±100ppm/K;阻值:3.24kΩ;功率:100mW;电阻类型:-;; LCSC Part Name: 3.24kΩ±1%; Supplier Part: C844165; Manufacturer: VISHAY(威世); Supplier Footprint: 0603; JLCPCB Part Class: 扩展库; Datasheet: https://atta.szlcsc.com/upload/public/pdf/source/20200922/C242478_0C7172CD6F5C3D507069694ED76193BB.pdf; Supplier: LCSC; Operating Temperature Range: -55~+155; Tolerance: ±1%; Overload Voltage (Max): 100V; Temperature Coefficient: ±100ppm/K; Power(Watts): 100mW
RF1 RF2 = DOSIN-801-0031: 连接器类型:板端;接口类型:-;端口数量:1;接口直径:-;接口长度/高度:-;频率-最大值:3GHz;射频系列:BNC;阻抗:75Ω;样式:弯头;触头镀层:-;工作温度范围:-55℃~+155℃;焊接温度(最大值):-;; LCSC Part Name: BNC 弯头 3件套; Supplier Part: C521205; Manufacturer: dosinconn(德索五金); Supplier Footprint: 插件; JLCPCB Part Class: 扩展库; Datasheet: https://atta.szlcsc.com/upload/public/pdf/source/20200430/C521205_EE53270F209019BCB4C8E965BBBFE6D0.pdf; Supplier: LCSC; Connector Type: 板端; Number of Ports: 1; Frequency-Max: 3GHz; RF Series: BNC; Impedance: 75Ω; Style: 弯头; Operating Temperature Range: -55℃~+155℃
SMA1-SMA3 = SMA: Supplier Part: C9900018296; JLCPCB Part Class: 扩展库; Supplier: LCSC
U17 U18 = GAQY212GSX: 触点形式:-;适用负载类型:-;正向压降(Vf):1.32V;负载电压:60V;连续负载电流:1A;导通电阻:180mΩ;; LCSC Part Name: 固态继电器; Supplier Part: C19271988; Manufacturer: SUPSiC(国晶微半导体); Supplier Footprint: SOP-4; JLCPCB Part Class: 扩展库; Datasheet: https://atta.szlcsc.com/upload/public/pdf/source/20241011/A89ED24ACAE58F7B7A4718E65AC52A14.pdf; Supplier: LCSC; Input Forward Voltage: 1.32V; Voltage - Load: 60V; Continuous Load Current: 1A; On Resistance: 180mΩ; Isolation Voltage(rms): 2.5kV; Turn-on time: 350us; Turn-off time: 100us
U19 U20 = CD4051BM96: 开关电路:单刀单掷(SPST);通道数:8;导通电阻(Ron@VCC):125Ω;; LCSC Part Name: 模拟多路复用器/解复用器; Supplier Part: C21379; Manufacturer: TI(德州仪器); Supplier Footprint: SOIC-16-150mil; Datasheet: https://www.ti.com/cn/lit/gpn/cd4051b; Supplier: LCSC; Switch Circuit: 单刀单掷(SPST); Number of Channels: 8; Supply Voltage: 3V~20V; On-State Resistance (Max): 125Ω; Operating Temperature: -55℃~+125℃
U22-U24 = RS8752XK: 放大器数:双路;增益带宽积(GBP):250MHz;输入偏置电流(Ib):1pA;输入失调电压(Vos):1.5mV;压摆率(SR):180V/us;带宽(-3db):-;轨到轨:-;; Supplier Part: C236994; Manufacturer: RUNIC(润石); Supplier Footprint: SOIC-8; JLCPCB Part Class: 扩展库; Datasheet: https://atta.szlcsc.com/upload/public/pdf/source/20180704/C236994_A30B17CACAFC1A4CBF965001C6F90802.pdf; Supplier: LCSC; Number of Circuits: 双路; Gain Bandwidth Product(GBP): 250MHz; Current - Input Bias(Ib): 1pA; Voltage - Input Offset(Vos): 1.5mV; Slew Rate(SR): 180V/us; Output Current: 125mA; Supply Current: 2.9mA; Operating Temperature: -40℃~+125℃
C57 C58 = CC0603KRX7R9BB104: 容值:100nF;精度:±10%;额定电压:50V;材质(温度系数):X7R;; LCSC Part Name: 100nF ±10% 50V; Supplier Part: C14663; Manufacturer: YAGEO(国巨); Supplier Footprint: 0603; JLCPCB Part Class: 基础库; Datasheet: https://atta.szlcsc.com/upload/public/pdf/source/20180910/C282072_33301C7F631E79921B82A8DAC6BCC5B3.pdf; Supplier: LCSC; Tolerance: ±10%; Voltage Rated: 50V; Temperature Coefficient: X7R
J1 = 排母_2X7P_2.54_双层_H8.5: 2X7P 双层 卧贴; Supplier: LCSC; Manufacturer: BOOMELE(博穆精密); Supplier Part: C38844; JLCPCB Part Class: 扩展库; LCSC Part Name: 间距:2.54mm 2x7P 直插; Supplier Footprint: 插件,P=2.54mm; Holes Structure: 2x7P; Pitch: 2.54mm; Row Spacing: 2.54mm; Mounting Type: 直插; Number of Rows: 双排; Number of Holes: 14P; Contact Material: 黄铜
R65-R68 = 0603WAF1002T5E: 电阻类型:厚膜电阻;阻值:10kΩ;精度:±1%;功率:100mW;; LCSC Part Name: 厚膜电阻 10kΩ ±1% 100mW; Supplier Part: C25804; Manufacturer: UNI-ROYAL(厚声); Supplier Footprint: 0603; JLCPCB Part Class: 基础库; Datasheet: https://atta.szlcsc.com/upload/public/pdf/source/20200306/C422600_1E6D84923E4A46A82E41ADD87F860B5C.pdf; Supplier: LCSC; Type: 厚膜电阻; Tolerance: ±1%; Power(Watts): 100mW; Temperature Coefficient: ±100ppm/℃; Overload Voltage (Max): 75V; Operating Temperature Range: -55℃~+155℃
R69 = 0603WAF1001T5E: 电阻类型:厚膜电阻;阻值:1kΩ;精度:±1%;功率:100mW;; LCSC Part Name: 1kΩ ±1% 100mW; Supplier Part: C21190; Manufacturer: UNI-ROYAL(厚声); Supplier Footprint: 0603; JLCPCB Part Class: Basic Part; Datasheet: https://atta.szlcsc.com/upload/public/pdf/source/20200306/C422600_1E6D84923E4A46A82E41ADD87F860B5C.pdf; Supplier: LCSC; Type: 厚膜电阻; Tolerance: ±1%; Power(Watts): 100mW; Temperature Coefficient: ±100ppm/℃; Overload Voltage (Max): 75V; Operating Temperature Range: -55℃~+155℃
R70 = 0603WAF5101T5E: 电阻类型:厚膜电阻;阻值:5.1kΩ;精度:±1%;功率:100mW;温度系数:±100ppm/℃;最大工作电压:75V;工作温度范围:-55℃~+155℃;; LCSC Part Name: 5.1kΩ ±1% 100mW; Supplier Part: C23186; Manufacturer: UNI-ROYAL(厚声); Supplier Footprint: 0603; JLCPCB Part Class: Basic Part; Datasheet: https://atta.szlcsc.com/upload/public/pdf/source/20200306/C422600_1E6D84923E4A46A82E41ADD87F860B5C.pdf; Supplier: LCSC; Type: 厚膜电阻; Tolerance: ±1%; Power(Watts): 100mW; Temperature Coefficient: ±100ppm/℃; Overload Voltage (Max): 75V; Operating Temperature Range: -55℃~+155℃
R71 R72 R75 R76 = 0603WAF1000T5E: 电阻类型:厚膜电阻;阻值:100Ω;精度:±1%;功率:100mW;; LCSC Part Name: 100Ω ±1% 100mW; Supplier Part: C22775; Manufacturer: UNI-ROYAL(厚声); Supplier Footprint: 0603; JLCPCB Part Class: 基础库; Datasheet: https://atta.szlcsc.com/upload/public/pdf/source/20200306/C422600_1E6D84923E4A46A82E41ADD87F860B5C.pdf; Supplier: LCSC; Type: 厚膜电阻; Tolerance: ±1%; Power(Watts): 100mW; Temperature Coefficient: ±200ppm/℃; Overload Voltage (Max): 75V; Operating Temperature Range: -55℃~+155℃
R73 R74 = 0603WAF2700T5E: 电阻类型:厚膜电阻;阻值:270Ω;精度:±1%;功率:100mW;; LCSC Part Name: 270Ω ±1% 100mW; Supplier Part: C22966; Manufacturer: UNI-ROYAL(厚声); Supplier Footprint: 0603; JLCPCB Part Class: Basic Part; Datasheet: https://atta.szlcsc.com/upload/public/pdf/source/20200306/C422600_1E6D84923E4A46A82E41ADD87F860B5C.pdf; Supplier: LCSC; Type: 厚膜电阻; Tolerance: ±1%; Power(Watts): 100mW; Temperature Coefficient: ±100ppm/℃; Overload Voltage (Max): 75V; Operating Temperature Range: -55℃~+155℃
U21 = CH32V305FBP6
X2 = CSTNE12M0GH5C000R0: 频率:12MHz;内置负载电容:33pF;谐振阻抗:30Ω;; LCSC Part Name: 12MHz ±0.07% 内置负载电容:33pF; Supplier Part: C2659460; Manufacturer: muRata(村田); Supplier Footprint: SMD3213-3P; JLCPCB Part Class: 扩展库; Datasheet: https://atta.szlcsc.com/upload/public/pdf/source/20211007/C2659460_6C3FEB8F7D5B458F9C6CAE4C602F43D9.pdf; Supplier: LCSC; Built-in Load Capacitance: 33pF; Resonant Impedance: 30Ω; Operating Temperature: -40℃~+125℃

## Nets
AGND: R46.1
GND: C1.1 C3.1 C4.1 C11.1 C12.1 C13.2 C17.2 C19.1 C20.1 C21.1 C22.1 C57.1 C58.2 C59.1 C60.1 C61.1 C62.1 C63.1 C64.1 C65.1 C68.1 C70.2 C71.2 C72.2 C73.2 C76.1 C77.1 C78.1 C79.1 C80.1 C81.1 C82.1 C83.1 C84.1 C85.1 C86.1 C87.1 C88.1 CN1.2 CN1.3 CN1.4 D1.2 EC1.6(1) EC1.7 EC1.C(3) EC1.E(6) EC2.6(1) EC2.7 EC2.C(3) EC2.E(6) EC3.6(1) EC3.7 EC3.C(3) EC3.E(6) EC4.6(1) EC4.7 EC4.C(3) EC4.E(6) FPC1.1 FPC1.11 FPC1.12 H1.2 H1.7 J1.3 LED5.1(C) LED7.2(GND) LED8.2(GND) LED9.2(GND) LED10.2(GND) LED11.2(GND) LED12.2(GND) LED13.2(GND) LED14.2(GND) LED15.2(GND) LED16.2(GND) P1.1 P1.7 P1.8 Q1.2(S) R4.1 R12.1 R14.2 R18.1 R19.2 R20.2 R66.1 R67.1 R68.1 R77.1 R86.1 R87.1 R88.1 R89.1 R90.1 R99.1 SW9.1 SW9.3 SW9.4 U1.15(VSS) U1.31(VSS) U1.47(VSS) U1.63(VSS) U2.2(GND) U2.5(WP) U13.1(ADJ(GND)) U16.3(GND) U16.9(EP) U21.18(VSS/GND) USB1.13(GND) USB1.14(GND) USB1.15(GND) USB1.16(GND) USB1.A1B12(GND) USB1.B1A12(GND) X1.2(GND) X2.2
GNDA: C14.1 C15.1 C16.1 C23.2 C24.2 C25.2 C26.2 C27.2 C28.2 C29.2 C30.2 C31.2 C32.2 C35.1 C36.1 C37.1 C38.1 C39.1 C40.1 C41.1 C42.1 C43.1 C44.1 C47.2 C48.1 C49.2 C50.1 C53.1 C54.1 C55.2 C56.2 C66.2 C67.2 C69.2 C74.2 C75.2 H3.3 H3.4 J2.1 J2.3 J2.4 J2.6 R14.1 R27.1 R28.1 R33.2 R34.2 R62.1 RF1.2 RF1.3 RF1.4 RF2.2 RF2.3 RF2.4 SMA1.1 SMA1.2 SMA1.3 SMA1.4 SMA2.1 SMA2.2 SMA2.3 SMA2.4 SMA3.1 SMA3.2 SMA3.3 SMA3.4 U1.27(VSSA) U12.3(GND) U14.4(GND) U15.1(ADJ(GND)) U17.2 U18.2 U19.6(INH) U19.8(VSS) U20.6(INH) U20.8(VSS)
VBAT: C21.2 C22.2 CN1.1 SW1.1 SW1.4 U16.5(BAT)
VCC: C13.1 C17.1 C68.2 C76.2 C77.2 C78.2 C79.2 C80.2 C81.2 C82.2 C83.2 C84.2 C85.2 H1.8 LED7.4(VDD) LED8.4(VDD) LED9.4(VDD) LED10.4(VDD) LED11.4(VDD) LED12.4(VDD) LED13.4(VDD) LED14.4(VDD) LED15.4(VDD) LED16.4(VDD) R3.2 R91.1 R98.1 SW1.2 SW1.5 U12.1(IN) U13.3(VIN) U15.3(VIN)
VDD: C1.2 C12.2 C58.1 C70.1 C71.1 C72.1 C73.1 C87.2 C88.2 FPC1.2 FPC1.7 J1.8 P1.6 R1.2 R2.2 R5.2 R65.2 R70.1 R79.1 R94.2 SW3.2 SW4.2 SW5.2 SW6.2 SW7.2 SW8.2 U1.1(VBAT) U1.16(VDD) U1.32(VDD) U1.48(VDD) U1.64(VDD) U2.4(VCC) U13.2(VOUT(TAB)) U21.14(VDD33/VIO)
VDDA: C14.2 C15.2 C23.1 C24.1 C25.1 C26.1 C27.1 C28.1 C29.1 C30.1 C31.1 C32.1 C74.1 H3.1 H3.2 U1.29(VDDA) U14.2(IN) U15.2(VOUT(TAB)) U19.16(VDD) U20.16(VDD) U22.8(+V) U23.8(+V) U24.8(+V)
VEEA: C16.2 C35.2 C36.2 C37.2 C38.2 C39.2 C40.2 C41.2 C42.2 C43.2 C44.2 H3.5 H3.6 U14.1(OUT) U19.7(VEE) U20.7(VEE) U22.4(-V) U23.4(-V) U24.4(-V)
AC/DC_CH1: R21.2 U1.19(PA5)
AC/DC_CH2: R22.2 U1.2(PC13)
BOOT0: C65.2 R90.2 SW8.1 U1.61(PB8-BOOT0)
BUTTON0: C63.2 R88.2 SW6.1 U1.24(PB0)
BUTTON1: C62.2 R87.2 SW5.1 U1.25(PB1)
BUTTON2: C61.2 R86.2 SW4.1 U1.14(PA2)
BUTTON3: C11.2 R12.2 SW3.1 U1.17(PA3)
BUTTON4: C64.2 R89.2 SW7.1 U1.22(PC4)
BUTTON_ADC: C86.2 EC1.D(5) R94.1 R95.2 U1.43(PA9)
CD_CH1_A: U1.23(PC5) U19.11(A)
CD_CH1_B: U1.37(PB15) U19.10(B)
CD_CH1_C: U1.42(PA8) U19.9(C)
CD_CH1_N: U19.3(COM OUT/IN) U22.2(-IN 1)
CD_CH1_OUT: C51.1 R45.2 U19.13(CHANNELS IN/OUT 0) U22.1(OUT 1)
CD_CH2_A: U1.3(PC14-OSC32_IN) U20.11(A)
CD_CH2_B: U1.4(PC15-OSC32_OUT) U20.10(B)
CD_CH2_C: U1.13(PA1) U20.9(C)
CD_CH2_N: U20.3(COM OUT/IN) U24.2(-IN 1)
CD_CH2_OUT: C52.1 R61.2 U20.13(CHANNELS IN/OUT 0) U24.1(OUT 1)
CS_ST: FPC1.5
D_RST_305: J1.12 U21.11(PC8)
D_SWCLK_305: R71.1 U21.6(PB13/SPI2_SCK/UART3_CTS/CAN2_TX) U21.15(PA14/SWCLK)
D_SWDIO_305: R69.1 R72.1 U21.13(PA9/UART1_RTS/PA13/SWDIO)
DDS_ON_CHIP: SMA1.5 U1.34(PB12)
DPO_CH1: R30.1 U1.35(PB13) U22.7(OUT 2)
DPO_CH1_F: C33.1 C47.1 C48.2 R24.1 R27.2 R52.1
DPO_CH2: R32.1 U1.21(PA7) U24.7(OUT 2)
DPO_CH2_F: C34.1 C49.1 C50.2 R26.1 R28.2 R64.1
DPO_REF_P: H2.1 H2.3 U1.36(PB14)
ENC1_1: EC1.A(2) U1.59(PB6)
ENC1_2: EC1.B(4) U1.60(PB7)
ENC3_1: EC4.A(2) U1.8(PC0)
ENC3_2: EC4.B(4) U1.9(PC1)
ENC4_1: EC3.A(2) U1.10(PC2)
ENC4_2: EC3.B(4) U1.26(PB2)
ENC20_1: EC2.A(2) U1.39(PC7)
ENC20_2: EC2.B(4) U1.38(PC6)
IAP_305: R65.1 R66.2 U21.10(PC7)
IIC_SCL: P1.5 R1.1 U1.40(PC8) U2.1(SCL)
IIC_SDA: P1.4 R2.1 U1.41(PC9) U2.3(SDA)
IN_CH1: C45.1 R23.1 RF1.1
IN_CH2: C46.1 R25.1 RF2.1
INT_FT: P1.3 U1.44(PA10)
LAT: H1.1 U1.57(PB4)
LED_CON_305: LED6.1(C) U21.12(PC9/PA8/UART1_RX)
LEDK: FPC1.8 R101.1
MODES_305: R67.2 U21.20(OSC_OUT/PD1) X2.3
NRST: C4.2 R5.1 SW9.2 U1.7(PG10-NRST)
OFFSET_CH1: R57.1 U1.20(PA6)
OFFSET_CH1_E: C55.1 R42.1 R48.1 U23.7(OUT 2)
OFFSET_CH2: R58.1 U1.18(PA4)
OFFSET_CH2_E: C56.1 R43.1 R50.1 U23.1(OUT 1)
OSC_IN_305: U21.19(OSC_IN/PD0) X2.1
PA0: H2.2 J2.2 J2.5 U1.12(PA0)
PA11: R83.2 U1.45(PA11)
PA12: R80.2 U1.46(PA12)
PA13: J1.10 U1.49(PA13)
PA14: J1.11 U1.50(PA14)
PA15: R100.2 U1.51(PA15)
PB3: H1.3 U1.56(PB3)
PB5: H1.5 U1.58(PB5)
PB9: H1.4 LED7.3(DI) R98.2 U1.62(PB9)
PB10: J1.14 U1.30(PB10)
PB11: J1.13 U1.33(PB11)
PB14_305: R75.1 U21.7(PB14/SPI2_MISO/UART3_RTS)
PB15_305: R76.1 U21.8(PB15/SPI2_MOSI/UART1_TX)
PC3: C3.2 R3.1 R4.2 U1.11(PC3)
PC6_305: R69.2 U21.9(PC6)
PC10: FPC1.4 U1.52(PC10)
PC11: FPC1.10 U1.53(PC11)
PC12: FPC1.3 U1.54(PC12)
PD2: FPC1.6 R93.2 U1.55(PD2)
RST_305: C57.2 R68.2 U21.1(RST#)
RST_FT: P1.2 R93.1
RX305: J1.2 R73.2
SOUT: H1.6
SWCLK/TCK305: J1.4 R71.2
SWDIO/TMS305: J1.5 R72.2
TDI305: J1.6 R76.2
TDO305: J1.9 R75.2
TX305: J1.1 R74.2
UART3_RX_305: R73.1 U21.4(PB11/UART3_RX/I2C2_SDA)
UART3_TX_305: R74.1 U21.3(PB10/UART3_TX/I2C2_SCL)
USB32P_N: C60.2 D1.4 R83.1 USB1.B7(DN2)
USB32P_P: C59.2 D1.6 R79.2 R80.1 USB1.B6(DP2)
USB305_N: D1.1 U21.16(PB6/USB2DM/UART1X_TX) USB1.A7(DN1)
USB305_P: D1.3 U21.17(PB7/USB2DP/UART1X_RX) USB1.A6(DP1)
VREF+: C69.1 C75.1 R35.1 R36.1 R47.2 R49.2 U1.28(VREF+) U12.2(OUT)
VUSB: C19.2 C20.2 D1.5 J1.7 R17.2 R78.2 R92.2 SW1.3 SW1.6 U16.4(VCC) USB1.A4B9(VBUS) USB1.B4A9(VBUS)
$1N891: U1.6(PF1-OSC_OUT) X1.1(OSC1)
$1N900: U1.5(PF0-OSC_IN) X1.3(OSC2)
$1N23358: LED7.1(DO) LED8.3(DI)
$1N23472: LED8.1(DO) LED9.3(DI)
$1N23593: LED9.1(DO) LED10.3(DI)
$1N23714: LED10.1(DO) LED11.3(DI)
$1N23835: LED11.1(DO) LED12.3(DI)
$1N23956: LED12.1(DO) LED13.3(DI)
$1N24077: LED13.1(DO) LED14.3(DI)
$1N24198: LED14.1(DO) LED15.3(DI)
$1N24319: LED15.1(DO) LED16.3(DI)
$1N25050: EC2.D(5) R95.1 R96.2
$1N25096: EC3.D(5) R96.1 R97.2
$1N25136: EC4.D(5) R97.1
$1N25337: Q1.1(G) R99.2 R100.1
$1N25463: Q1.3(D) R101.2
$2N1269: R20.1 USB1.B5(CC2)
$2N1277: R19.1 USB1.A5(CC1)
$2N1321: C18.2 U14.5(CFLY+)
$2N1373: C18.1 U14.3(CFLY-)
$2N3996: R18.2 U16.2(PROG)
$2N4003: LED3.1(C) U16.7(CHRG)
$2N4004: LED4.1(C) U16.6(STDBY)
$2N4883: R77.2 U16.1(TEMP)
$2N4925: R78.1 U16.8(CE)
$2N6641: LED5.2(A) R91.2
$2N6678: LED4.2(A) R92.1
$2N6681: LED3.2(A) R17.1
$3N3875: C54.2 R34.1 R36.2 R43.2 U24.5(+IN 2)
$3N4010: C53.2 R33.1 R35.2 R42.2 U22.5(+IN 2)
$3N4202: C51.2 R29.2
$3N4208: R29.1 R30.2 U22.6(-IN 2)
$3N4263: C52.2 R31.2
$3N4269: R31.1 R32.2 U24.6(-IN 2)
$3N4651: R49.1 R50.2 U23.2(-IN 1)
$3N4719: R47.1 R48.2 U23.6(-IN 2)
$3N4828: C66.1 R57.2 U23.5(+IN 2)
$3N4856: C67.1 R58.2 U23.3(+IN 1)
$3N6804: R64.2 U24.3(+IN 1)
$3N6808: R52.2 U22.3(+IN 1)
$3N7920: R54.2 R56.2 U20.12(CHANNELS IN/OUT 3)
$3N7921: R59.1 R61.1 U20.14(CHANNELS IN/OUT 1)
$3N7922: R56.1 R59.2 U20.15(CHANNELS IN/OUT 2)
$3N8116: R55.2 R60.1 U20.2(IN/OUT 6)
$3N8118: R53.1 R55.1 U20.5(IN/OUT 5)
$3N8119: R53.2 R54.1 U20.1(CHANNELS 4)
$3N8120: R60.2 R62.2 U20.4(CHANNELS 7)
$3N8594: R38.2 R40.2 U19.12(CHANNELS IN/OUT 3)
$3N8595: R41.1 R45.1 U19.14(CHANNELS IN/OUT 1)
$3N8598: R40.1 R41.2 U19.15(CHANNELS IN/OUT 2)
$3N8602: R39.2 R44.1 U19.2(IN/OUT 6)
$3N8603: R37.1 R39.1 U19.5(IN/OUT 5)
$3N8605: R37.2 R38.1 U19.1(CHANNELS 4)
$3N8619: R44.2 R46.2 U19.4(CHANNELS 7)
$3N8929: C33.2 C45.2 R24.2 U17.3
$3N10125: R23.2 U17.4
$3N10859: C34.2 C46.2 R26.2 U18.3
$3N10862: R25.2 U18.4
$3N10903: R21.1 U17.1
$3N10977: R22.1 U18.1
$4N3306: LED6.2(A) R70.2

Not connected (* = marked no-connect by the designer): FPC1 9*; LED16 1(DO); SMA2 5*; SMA3 5*; U21 2(PA5/UART1_CTS/PA1 (no5V))* 5(PB12/SPI2_NSS/CAN2_RX)*; USB1 A8(SBU1)* B8(SBU2)*

## Notes on the sheets
sheet 3
- 抬升/偏置信号
- 5 10
  6 20
  7 40
- 0.75V
- OFFSET_E=2*OFFSET-VREF
- 0.75V
sheet 4
- Single-wire debug use
- PA5 is used to enable a 3V3 power supply
- PB12 is used to enable a 5V power supply
